# Altium schematic sheet [2] - Power budget.SchDoc
size A4; Organization: Altium Limited; Address1: L3, 12a Rodborough Rd; Address2: Frenchs Forest; Address3: NSW; Address4: Australia 2086
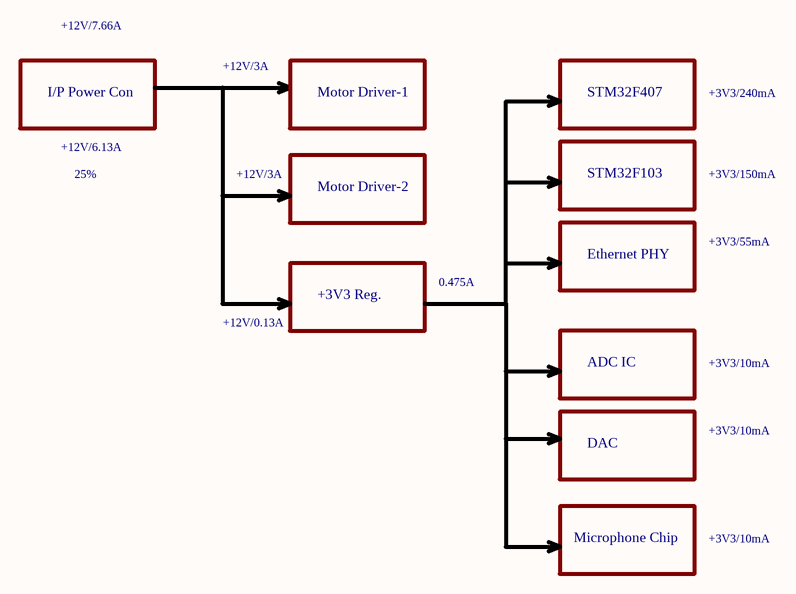
[diagram p0: [2] - Power budget.SchDoc]

## Notes on the sheet
- +12V/7.66A
- I/P Power Con
- +12V/3A
- Motor Driver-1
- STM32F407
- +3V3/240mA
- +12V/6.13A
- 25%
- STM32F103
- +3V3/150mA
- Motor Driver-2
- +3V3/55mA
- +3V3 Reg.
- 0.475A
- Ethernet PHY
- +12V/0.13A
- ADC IC
- +3V3/10mA
- DAC
- Microphone Chip
- Title
- Size:
- Date:
- A4
- Number:
- Time:
- Revision:
- Sheet
- of
- File: